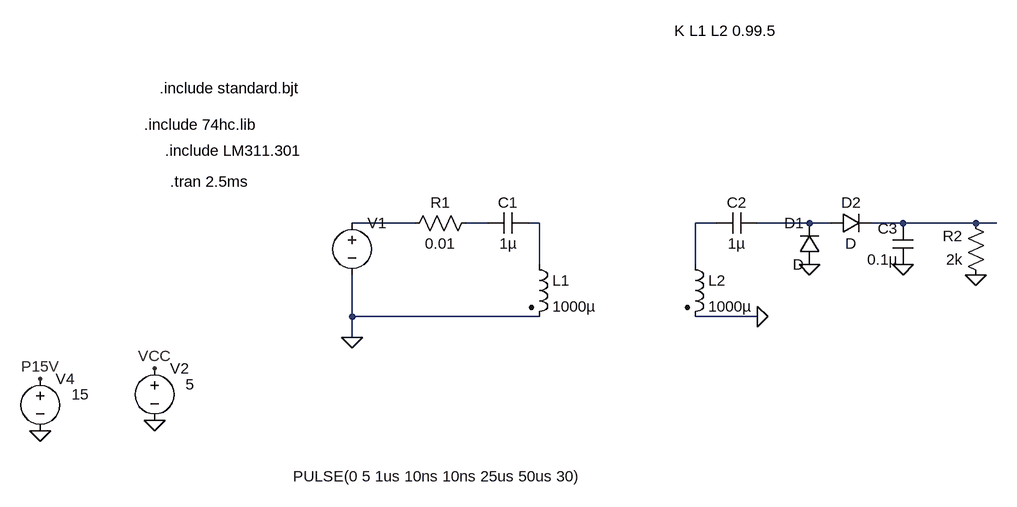
[diagram p0: schematic Draft99.asc]
Draft99.asc, the LTspice schematic file:
Version 4
SHEET 1 5720 1740
WIRE 208 -160 112 -160
WIRE 320 -160 288 -160
WIRE 400 -160 384 -160
WIRE 672 -160 640 -160
WIRE 816 -160 736 -160
WIRE 848 -160 816 -160
WIRE 960 -160 912 -160
WIRE 1072 -160 960 -160
WIRE 1104 -160 1072 -160
WIRE 400 -96 400 -160
WIRE 640 -96 640 -160
WIRE 112 -16 112 -80
WIRE 400 -16 112 -16
WIRE 736 -16 640 -16
WIRE 112 16 112 -16
FLAG -192 144 0
FLAG -192 64 VCC
FLAG -368 160 0
FLAG -368 80 P15V
FLAG 736 -16 0
FLAG 1072 -80 0
FLAG 816 -96 0
FLAG 112 16 0
FLAG 960 -96 0
SYMBOL voltage -192 48 R0
WINDOW 123 0 0 Left 0
WINDOW 39 0 0 Left 0
WINDOW 3 48 40 Left 2
SYMATTR Value 5
SYMATTR InstName V2
SYMBOL ind2 384 -112 R0
SYMATTR InstName L1
SYMATTR Value 1000µ
SYMATTR Type ind
SYMBOL voltage -368 64 R0
WINDOW 123 0 0 Left 0
WINDOW 39 0 0 Left 0
WINDOW 3 48 40 Left 2
SYMATTR Value 15
SYMATTR InstName V4
SYMBOL ind2 624 -112 R0
SYMATTR InstName L2
SYMATTR Value 1000µ
SYMATTR Type ind
SYMBOL voltage 112 -176 R0
WINDOW 123 0 0 Left 0
WINDOW 39 0 0 Left 0
WINDOW 3 -91 406 Left 2
SYMATTR Value PULSE(0 5 1us 10ns 10ns 25us 50us 30)
SYMATTR InstName V1
SYMBOL res 304 -176 R90
WINDOW 0 0 56 VBottom 2
WINDOW 3 32 56 VTop 2
SYMATTR InstName R1
SYMATTR Value 0.01
SYMBOL res 1088 -64 R180
WINDOW 0 36 76 Left 2
WINDOW 3 36 40 Left 2
SYMATTR InstName R2
SYMATTR Value 2k
SYMBOL diode 832 -96 R180
WINDOW 0 24 64 Left 2
WINDOW 3 24 0 Left 2
SYMATTR InstName D1
SYMBOL cap 384 -176 R90
WINDOW 0 0 32 VBottom 2
WINDOW 3 32 32 VTop 2
SYMATTR InstName C1
SYMATTR Value 1µ
SYMBOL cap 736 -176 R90
WINDOW 0 0 32 VBottom 2
WINDOW 3 32 32 VTop 2
SYMATTR InstName C2
SYMATTR Value 1µ
SYMBOL diode 848 -144 R270
WINDOW 0 32 32 VTop 2
WINDOW 3 0 32 VBottom 2
SYMATTR InstName D2
SYMBOL cap 976 -96 R180
WINDOW 0 24 56 Left 2
WINDOW 3 24 8 Left 2
SYMATTR InstName C3
SYMATTR Value 0.1µ
TEXT -168 -224 Left 2 !.tran 2.5ms
TEXT -208 -312 Left 2 !.include 74hc.lib
TEXT 608 -456 Left 2 !K L1 L2 0.99.5
TEXT -184 -368 Left 2 !.include standard.bjt
TEXT -176 -272 Left 2 !.include LM311.301

The netlist it stands for:
* Draft99.asc
V2 VCC 0 5
L1 N003 0 1000µ
V4 P15V 0 15
L2 N004 0 1000µ
V1 N001 0 PULSE(0 5 1us 10ns 10ns 25us 50us 30)
R1 N002 N001 0.01
R2 0 N006 2k
D1 0 N005 D
C1 N003 N002 1µ
C2 N005 N004 1µ
D2 N005 N006 D
C3 0 N006 0.1µ
.model D D
.lib standard.dio
.tran 2.5ms
.include 74hc.lib
K L1 L2 0.99.5
.include standard.bjt
.include LM311.301
.backanno
.end